# EAGLE design SmartSwitchBoard (EAGLE 6.2)
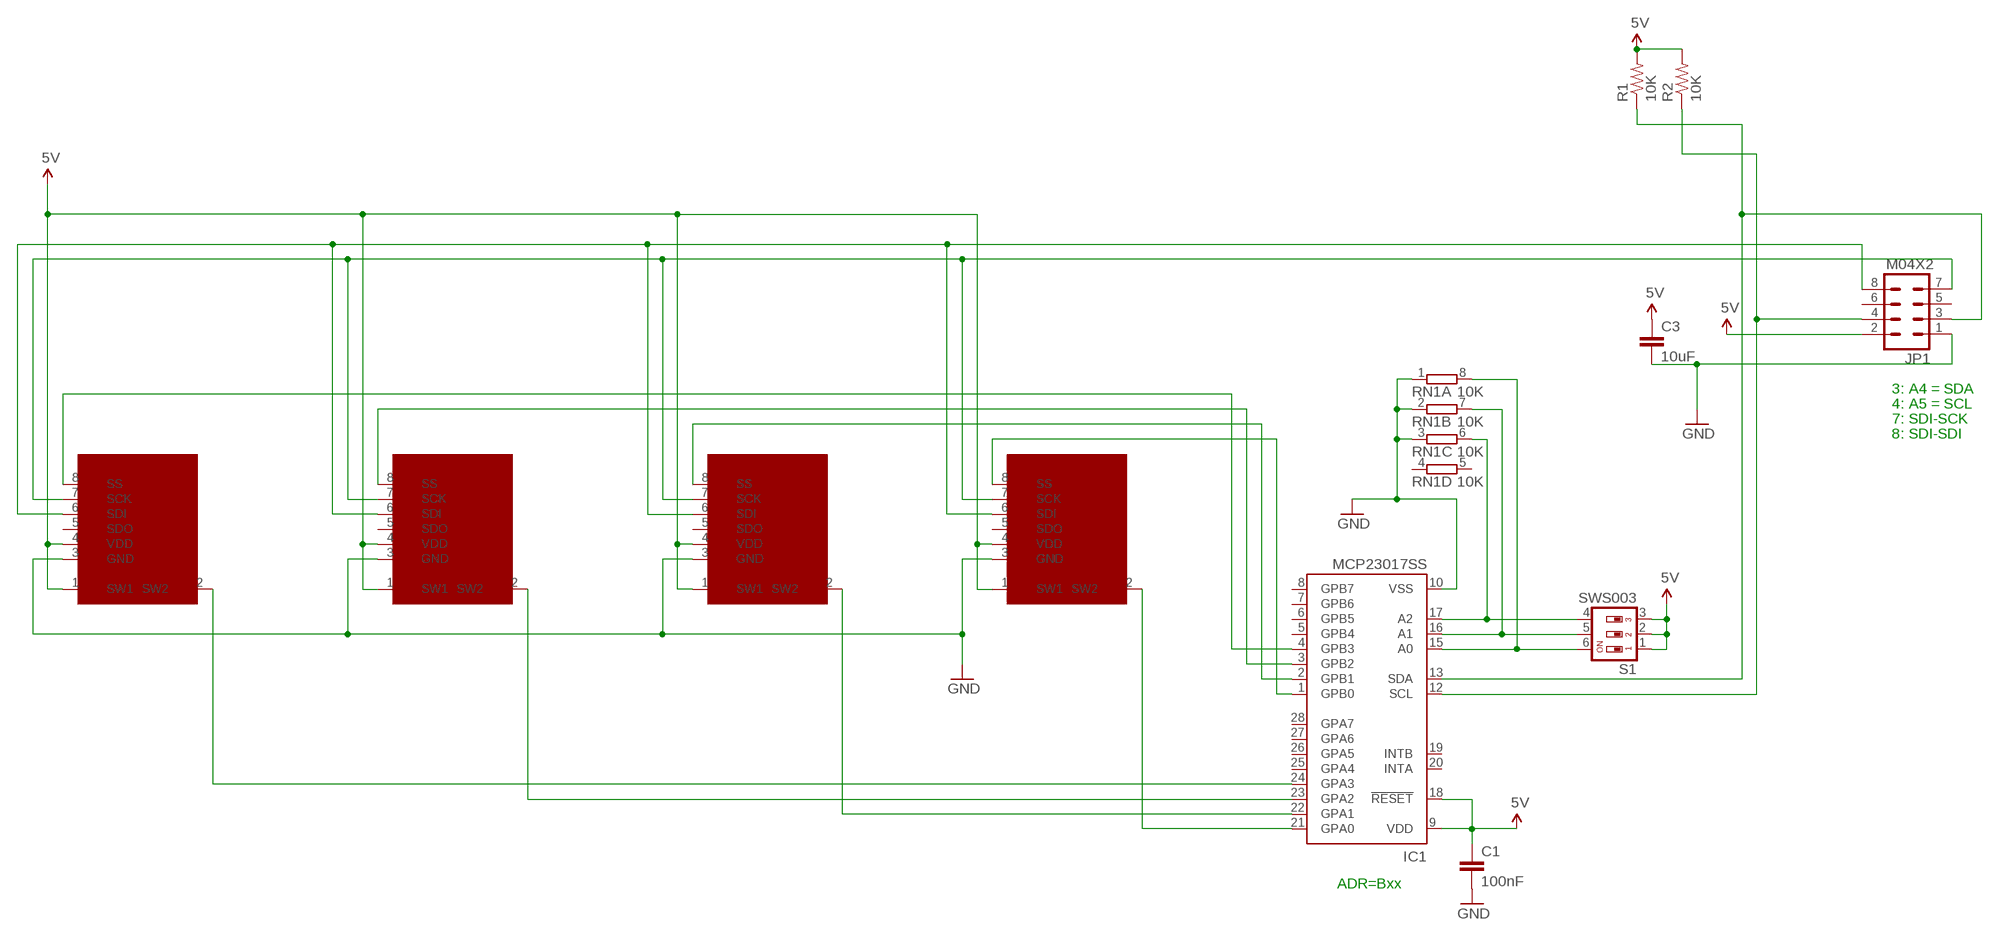
[diagram p0: schematic, sheet 1]

## Parts
C1  100nF  CAP0603-CAP  [0603-CAP]
C3  10uF  CAP0805  [0805]
IC1  MCP23017SS  [SSOP28]
JP1  M04X2  [2X4]
R1  10K  RESISTOR0603-RES  [0603-RES]
R2  10K  RESISTOR0603-RES  [0603-RES]
RN1  10K  4R-NCAY16  [CAY16_HAND]
S1  SWS003  [SMS-003]
U$3  SMART_SWITCH  [SMART_SWITCH]
U$4  SMART_SWITCH  [SMART_SWITCH]
U$5  SMART_SWITCH  [SMART_SWITCH]
U$6  SMART_SWITCH  [SMART_SWITCH]

## Nets
5V [Power]: C1.1 C3.1 IC1.9(VDD) IC1.18(!RESET) JP1.2 R1.2 R2.2 S1.1 S1.2 S1.3 U$3.1(SW1) U$3.4(VDD) U$4.1(SW1) U$4.4(VDD) U$5.1(SW1) U$5.4(VDD) U$6.1(SW1) U$6.4(VDD)
GND [Power]: C1.2 C3.2 IC1.10(VSS) JP1.1 RN1.1 RN1.2 RN1.3 U$3.3(GND) U$4.3(GND) U$5.3(GND) U$6.3(GND)
N$1: IC1.15(A0) RN1.8 S1.6
N$2: IC1.16(A1) RN1.7 S1.5
N$3: IC1.13(SDA) JP1.3 R1.1
N$4: IC1.17(A2) RN1.6 S1.4
N$6: IC1.12(SCL) JP1.4 R2.1
N$7: JP1.7 U$3.7(SCK) U$4.7(SCK) U$5.7(SCK) U$6.7(SCK)
N$8: JP1.8 U$3.6(SDI) U$4.6(SDI) U$5.6(SDI) U$6.6(SDI)
N$11: IC1.1(GPB0) U$3.8(SS)
N$12: IC1.2(GPB1) U$4.8(SS)
N$13: IC1.3(GPB2) U$5.8(SS)
N$14: IC1.4(GPB3) U$6.8(SS)
N$38: IC1.24(GPA3) U$6.2(SW2)
N$39: IC1.23(GPA2) U$5.2(SW2)
N$41: IC1.21(GPA0) U$3.2(SW2)
N$42: IC1.22(GPA1) U$4.2(SW2)
Unconnected: IC1.5(GPB4) IC1.6(GPB5) IC1.7(GPB6) IC1.8(GPB7) IC1.19(INTB) IC1.20(INTA) IC1.25(GPA4) IC1.26(GPA5) IC1.27(GPA6) IC1.28(GPA7) JP1.5 JP1.6 RN1.4 RN1.5 U$3.5(SDO) U$4.5(SDO) U$5.5(SDO) U$6.5(SDO)

## Notes on the sheet
- 3: A4 = SDA
- 4: A5 = SCL
- 7: SDI-SCK
- 8: SDI-SDI
- ADR=Bxx

## Library data of the parts
C1 C3 = SparkFun:CAP: Capacitor Standard 0603 ceramic capacitor, and 0.1" leaded capacitor.
IC1 = microchip:MCP23017: http://ww1.microchip.com/downloads/en/DeviceDoc/21952a.pdf Source: http://ww1.microchip.com/downloads/en/DeviceDoc/21952a.pdf; MF: MICROCHIP; MPN: MCP23017-E/SS; OC_FARNELL: 1467674; OC_NEWARK: 31K2960
JP1 = SparkFun:M04X2
R1 R2 = SparkFun:RESISTOR: Resistor Basic schematic elements and footprints for 0603, 1206, and PTH resistors.
RN1 = SKAARHOJ:4R-N: Array Chip Resistor Source: RS Component / Phycomp; OC_FARNELL: unknown; OC_NEWARK: unknown
S1 = smd-special:SWS003: SMD Dip Switch 3 pol.
U$3-U$6 = SKAARHOJ:SMART_SWITCH: SMARTSWITCH IS15DSBFP4RGB www.nkksmartswitch.com

## Net classes
1 Power: width 0.305 mm, clearance 0.203 mm

## Board
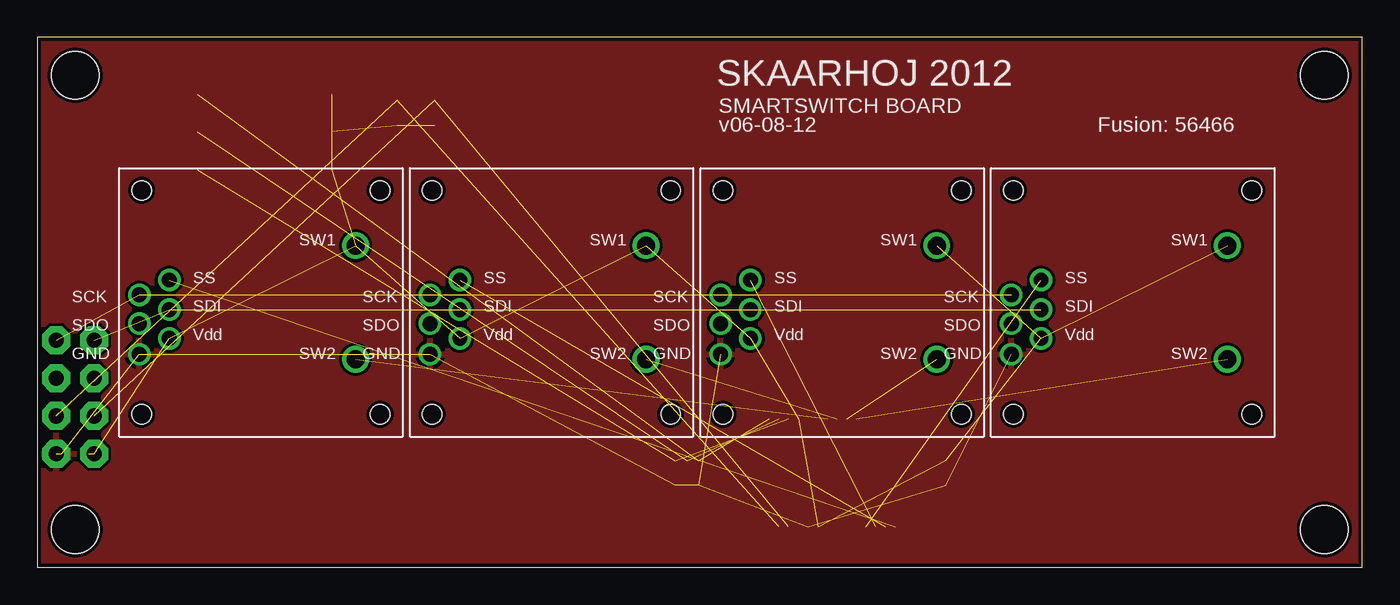
[diagram p1: board, top side]
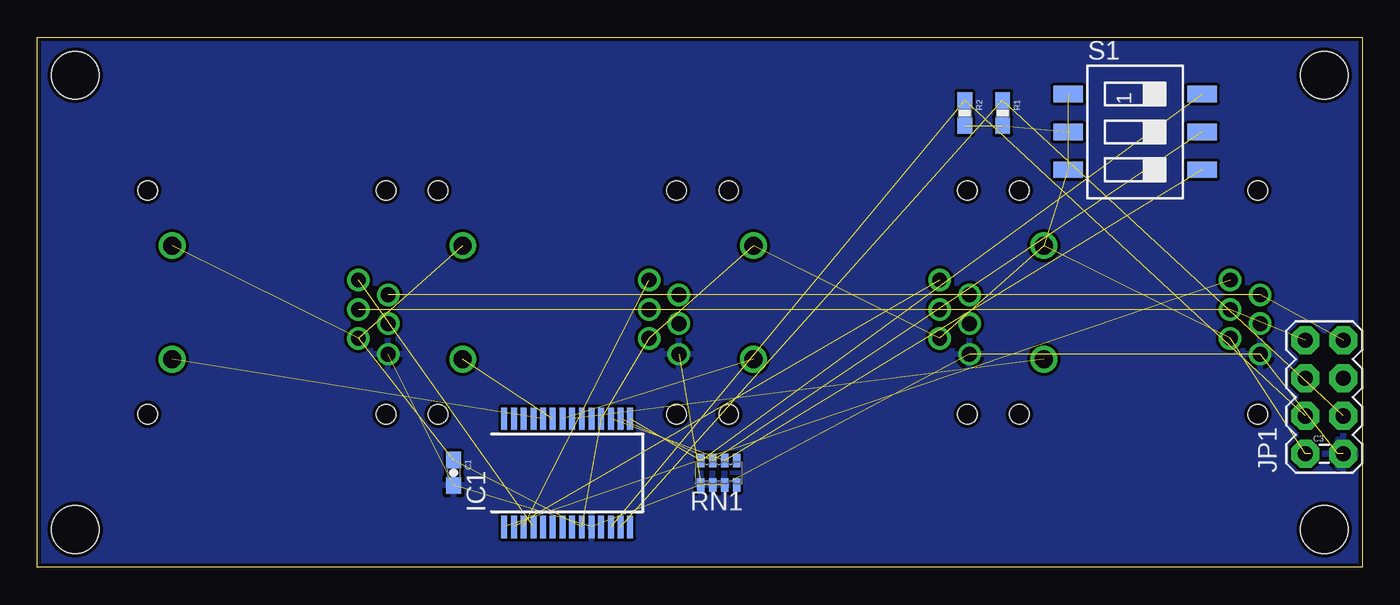
[diagram p2: board, bottom side, seen from below]

Size 88.9 x 35.56 mm. Coordinates in mm from the lower left corner, seen from the top.
Outline: 0,0 88.9,0 88.9,35.56 0,35.56 0,0
Copper layers (1*16): Top 0.035mm / dielectric 1.5mm / Bottom 0.035mm
Design rules: minimum track width 6mil, minimum drill 12mil, track to track 6mil, track to pad 6mil, pad to pad 6mil, via to via 6mil, smd to smd 0mil, copper to edge 10mil, drill to drill 10mil, minimum pad ring 10mil, minimum via ring 6mil, stop-mask expansion 2mil, vias tented up to drill 100mil, thermal gap 10mil
Holes 3.2 mm at 2.54,2.54 2.54,33.02 86.36,33.02 86.36,2.54

### Footprints (pad centres in the part's own frame; a part is rotated, then mirrored left to right if it is on the bottom)
0603-CAP = smd 1.1 x 1: 1 -0.85,0; 2 0.85,0
0805 = smd 0.8 x 1.2: 1 -0.9,0; 2 0.9,0
SSOP28 = smd 0.4 x 1.5: 1 -4.225,-3.625; 2 -3.575,-3.625; 3 -2.925,-3.625; 4 -2.275,-3.625; 5 -1.625,-3.625; 6 -0.975,-3.625; 7 -0.325,-3.625; 8 0.325,-3.625; 9 0.975,-3.625; 10 1.625,-3.625; 11 2.275,-3.625; 12 2.925,-3.625; 13 3.575,-3.625; 14 4.225,-3.625; 15 4.225,3.625; 16 3.575,3.625; 17 2.925,3.625; 18 2.275,3.625; 19 1.625,3.625; 20 0.975,3.625; 21 0.325,3.625; 22 -0.325,3.625; 23 -0.975,3.625; 24 -1.625,3.625; 25 -2.275,3.625; 26 -2.925,3.625; 27 -3.575,3.625; 28 -4.225,3.625
2X4 = drill 1.016 pad 1.88 octagon: 1 -3.81,-1.27; 2 -3.81,1.27; 3 -1.27,-1.27; 4 -1.27,1.27; 5 1.27,-1.27; 6 1.27,1.27; 7 3.81,-1.27; 8 3.81,1.27
0603-RES = smd 1.1 x 1: 1 -0.85,0; 2 0.85,0
CAY16_HAND = smd 0.5 x 0.904: 1 -1.2,-0.813; 2 -0.4,-0.813; 3 0.4,-0.813; 4 1.2,-0.813; 5 1.2,0.813; 6 0.4,0.813; 7 -0.4,0.813; 8 -1.2,0.813
SMS-003 = smd 1.092 x 2.007: 1 -2.54,-4.496; 2 0,-4.496; 3 2.54,-4.496; 4 2.54,4.496; 5 0,4.496; 6 -2.54,4.496
SMART_SWITCH = drill 1.2: 1 6.35,3.81; 2 6.35,-3.81 | drill 1: 3 -8.153,-3.48; 4 -6.147,-2.413; 5 -8.153,-1.422; 6 -6.147,-0.483; 7 -8.153,0.508; 8 -6.147,1.499 | hole 1.3: -8.001,7.506; 8.001,7.506; 8.001,-7.506; -8.001,-7.506

### Placement (x,y rotation side)
C1  60.96,6.35 270 bottom
C3  2.54,7.62 0 bottom
IC1  53.34,6.35 0 bottom
JP1  2.54,11.43 90 bottom
R1  24.13,30.48 270 bottom
R2  26.67,30.48 270 bottom
RN1  43.18,6.35 0 bottom
S1  15.24,29.21 270 bottom
U$3  15,17.78 0 top
U$4  34.5,17.78 0 top
U$5  54,17.78 0 top
U$6  73.5,17.78 0 top

### Tracks (layer width: path | path; a pad name or v marks a point on that pad's centre or on a via)
5V  (17 unrouted)
GND  (10 unrouted)
  pour Top: 0,0 88.9,0 88.9,35.56 0,35.56
  pour Bottom: 0,0 88.9,0 88.9,35.56 0,35.56
N$1  (2 unrouted)
N$2  (2 unrouted)
N$3  (2 unrouted)
N$4  (2 unrouted)
N$6  (2 unrouted)
N$7  (4 unrouted)
N$8  (4 unrouted)
N$11  (1 unrouted)
N$12  (1 unrouted)
N$13  (1 unrouted)
N$14  (1 unrouted)
N$38  (1 unrouted)
N$39  (1 unrouted)
N$41  (1 unrouted)
N$42  (1 unrouted)

### Text on the board
_tsilk: SKAARHOJ 2012 | SMARTSWITCH BOARD | v06-08-12 | Fusion: 56466